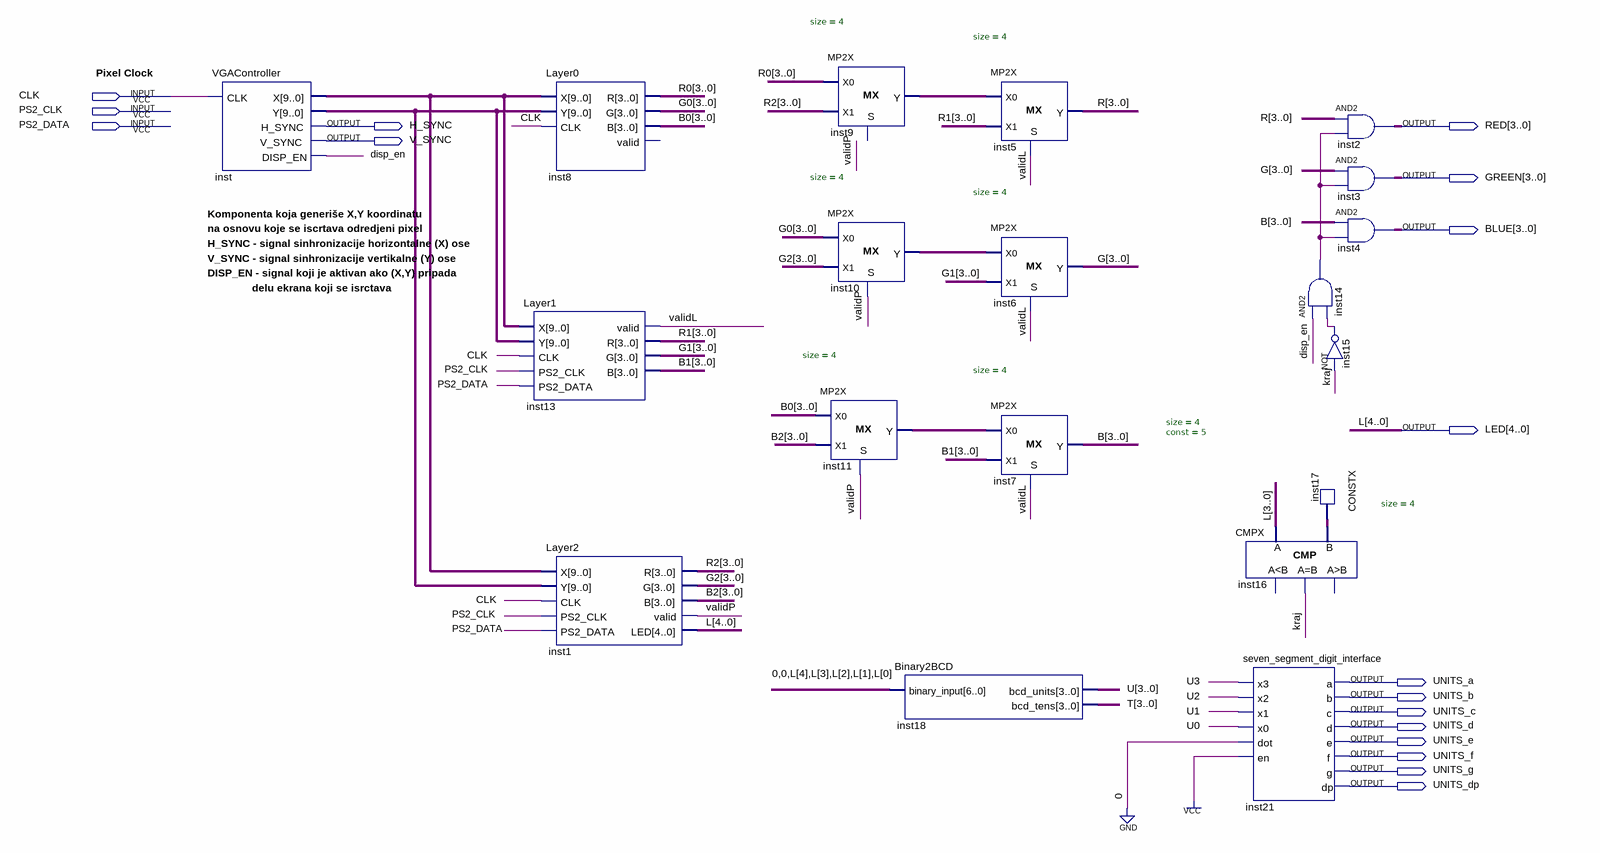
[diagram p0: schematic sheet]
// Quartus schematic Lab2Demo.bdf as structural Verilog: 19 symbols, 17 pins
module Lab2Demo (
  input  CLK,
  input  PS2_CLK,
  input  PS2_DATA,
  output H_SYNC,
  output [3:0] RED,
  output V_SYNC,
  output [3:0] GREEN,
  output [3:0] BLUE,
  output [4:0] LED,
  output UNITS_a,
  output UNITS_b,
  output UNITS_c,
  output UNITS_d,
  output UNITS_e,
  output UNITS_f,
  output UNITS_g,
  output UNITS_dp
);

  wire disp_en, inst14_out, inst15_out, kraj, validL, validP;
  wire [3:0] B, B0, B1, B2, G, G0, G1, G2, inst9_y, inst10_y, inst11_y, inst17_data, R, R0, R1, R2, T, U;
  wire [9:0] inst_x, inst_y;

  VGAController inst (.CLK(CLK), .X(inst_x), .Y(inst_y), .H_SYNC(H_SYNC), .V_SYNC(V_SYNC), .DISP_EN(disp_en));
  Layer0 inst8 (.X(inst_x), .Y(inst_y), .CLK(CLK), .R(R0), .G(G0), .B(B0));  // open: valid
  Layer1 inst13 (
    .X(inst_x), .Y(inst_y), .CLK(CLK), .PS2_CLK(PS2_CLK), .PS2_DATA(PS2_DATA), .valid(validL), .R(R1),
    .G(G1), .B(B1));
  Layer2 inst1 (
    .X(inst_x), .Y(inst_y), .CLK(CLK), .PS2_CLK(PS2_CLK), .PS2_DATA(PS2_DATA), .R(R2), .G(G2), .B(B2),
    .valid(validP), .LED(LED));
  MP2X #(.size(4)) inst9 (.X0(R0), .X1(R2), .Y(inst9_y));  // open: S
  MP2X #(.size(4)) inst10 (.S(validP), .X0(G0), .X1(G2), .Y(inst10_y));
  MP2X #(.size(4)) inst11 (.S(validP), .X0(B0), .X1(B2), .Y(inst11_y));
  Binary2BCD inst18 (.binary_input({2'b00, LED}), .bcd_units(U), .bcd_tens(T));
  MP2X #(.size(4)) inst5 (.S(validL), .X0(inst9_y), .X1(R1), .Y(R));
  MP2X #(.size(4)) inst6 (.S(validL), .X0(inst10_y), .X1(G1), .Y(G));
  MP2X #(.size(4)) inst7 (.S(validL), .X0(inst11_y), .X1(B1), .Y(B));
  CMPX #(.size(4)) inst16 (.A(LED[3:0]), .B(inst17_data), .eq(kraj));  // open: ls, gr
  seven_segment_digit_interface inst21 (
    .x3(U[3]), .x2(U[2]), .x1(U[1]), .x0(U[0]), .dot(1'b0), .en(1'b1), .a(UNITS_a), .b(UNITS_b), .c(UNITS_c),
    .d(UNITS_d), .e(UNITS_e), .f(UNITS_f), .g(UNITS_g), .dp(UNITS_dp));
  assign RED = R & {4{inst14_out}};  // AND2 inst2, 4 bits wide
  assign GREEN = G & {4{inst14_out}};  // AND2 inst3, 4 bits wide
  assign BLUE = B & {4{inst14_out}};  // AND2 inst4, 4 bits wide
  and inst14 (inst14_out, disp_en, inst15_out);
  not inst15 (inst15_out, kraj);
  CONSTX #(.size(4), .\const (5)) inst17 (.data(inst17_data));

  // Other names for the same wires on the sheet: L[4:0] = LED

  // Notes on the sheet:
  //   Pixel Clock
  //   Komponenta koja generiše X,Y koordinatu
  //   na osnovu koje se iscrtava odredjeni pixel
  //   H_SYNC - signal sinhronizacije horizontalne (X) ose
  //   V_SYNC - signal sinhronizacije vertikalne (Y) ose
  //   DISP_EN - signal koji je aktivan ako (X,Y) pripada
  //   delu ekrana koji se isrctava
endmodule
